# EAGLE design Carrier (corrected) (EAGLE 7.6.0)
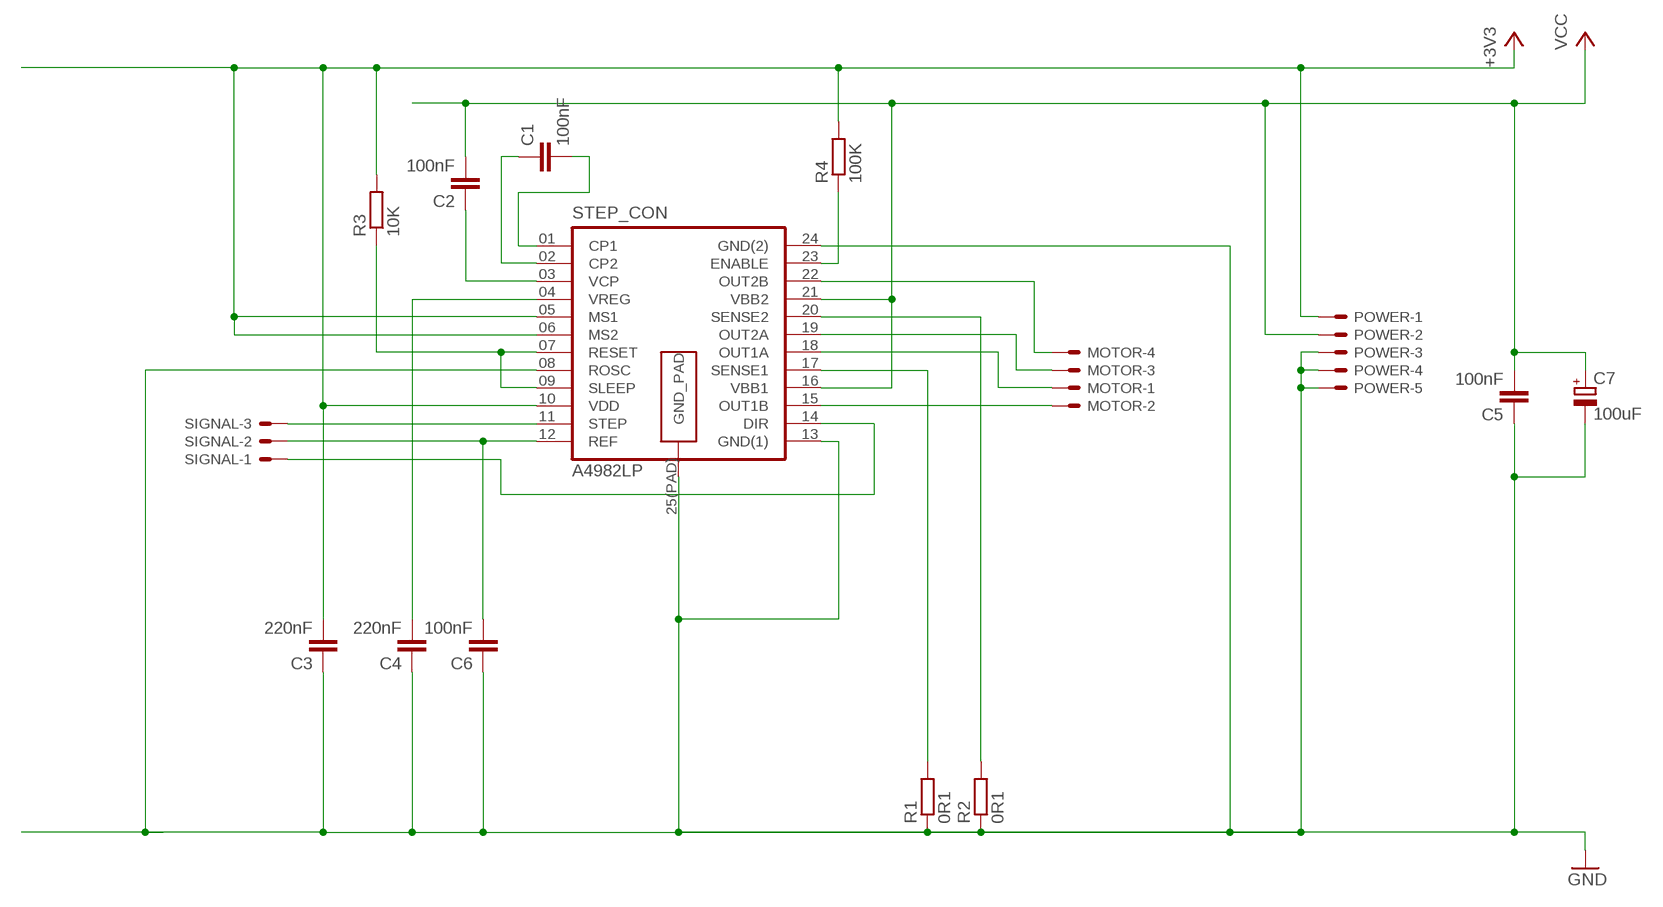
[diagram p0: schematic, sheet 1]

## Parts
C1  100nF  C-EUC1206  [C1206]
C2  100nF  C-EUC1206  [C1206]
C3  220nF  C-EUC1206  [C1206]
C4  220nF  C-EUC1206  [C1206]
C5  100nF  C-EUC1206  [C1206]
C6  100nF  C-EUC1206  [C1206]
C7  100uF  CPOL-EUB45181A  [B45181A]
MOTOR  KK-156-4  [KK-156-4]
POWER  KK-156-5  [KK-156-5]
R1  0R1  R-EU_M0805  [M0805]
R2  0R1  R-EU_M0805  [M0805]
R3  10K  R-EU_M0805  [M0805]
R4  100K  R-EU_M0805  [M0805]
SIGNAL  KK-156-3  [KK-156-3]
STEP_CON  A4982LP  [A4982LP]

## Nets
+3V3: C3.2 POWER.1 R3.2 R4.2 STEP_CON.05(MS1) STEP_CON.06(MS2) STEP_CON.10(VDD)
CP1: C1.2 STEP_CON.01(CP1)
CP2: C1.1 STEP_CON.02(CP2)
DIR: SIGNAL.1 STEP_CON.14(DIR)
ENABLE: R4.1 STEP_CON.23(ENABLE)
GND: C3.1 C4.1 C5.1 C6.1 C7.- POWER.3 POWER.4 POWER.5 R1.1 R2.1 STEP_CON.08(ROSC) STEP_CON.13(GND(1)) STEP_CON.24(GND(2)) STEP_CON.25(PAD)(GND_PAD)
OUT1A: MOTOR.1 STEP_CON.18(OUT1A)
OUT1B: MOTOR.2 STEP_CON.15(OUT1B)
OUT2: MOTOR.3 STEP_CON.19(OUT2A)
OUT2B: MOTOR.4 STEP_CON.22(OUT2B)
REF: C6.2 SIGNAL.2 STEP_CON.12(REF)
RESET+SLEEP: R3.1 STEP_CON.07(RESET) STEP_CON.09(SLEEP)
SENSE: R2.2 STEP_CON.20(SENSE2)
SENSE1: R1.2 STEP_CON.17(SENSE1)
STEP: SIGNAL.3 STEP_CON.11(STEP)
VCC: C2.2 C5.2 C7.+ POWER.2 STEP_CON.16(VBB1) STEP_CON.21(VBB2)
VCP: C2.1 STEP_CON.03(VCP)
VREG: C4.2 STEP_CON.04(VREG)

## Library data of the parts
C1-C6 = rcl:C-EU: CAPACITOR, European symbol
C7 = rcl:CPOL-EU: POLARIZED CAPACITOR, European symbol
MOTOR = con-molex:KK-156-4: KK 156 HEADER Source: http://www.molex.com/pdm_docs/sd/026604100_sd.pdf; OC_FARNELL: unknown; OC_NEWARK: unknown
POWER = con-molex:KK-156-5: KK 156 HEADER Source: http://www.molex.com/pdm_docs/sd/026604100_sd.pdf; OC_FARNELL: unknown; OC_NEWARK: unknown
R1-R4 = rcl:R-EU_: RESISTOR, European symbol
SIGNAL = con-molex:KK-156-3: KK 156 HEADER Source: http://www.molex.com/pdm_docs/sd/026604100_sd.pdf; OC_FARNELL: unknown; OC_NEWARK: unknown
STEP_CON = allegro:A4982LP

## Board
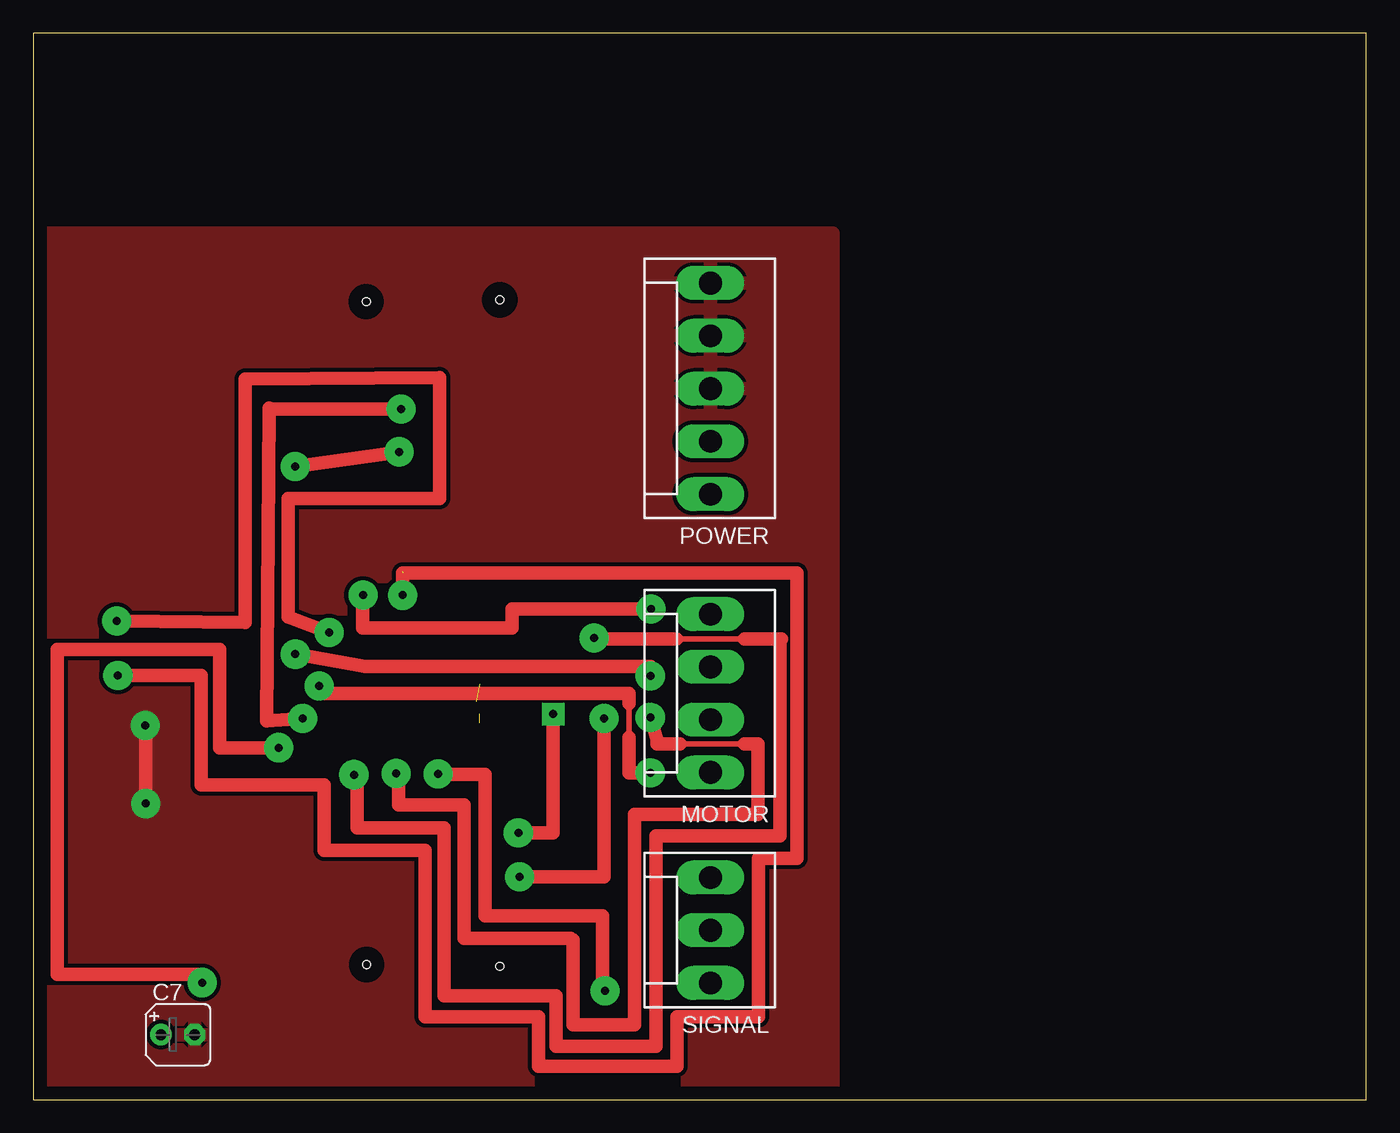
[diagram p1: board, top side]
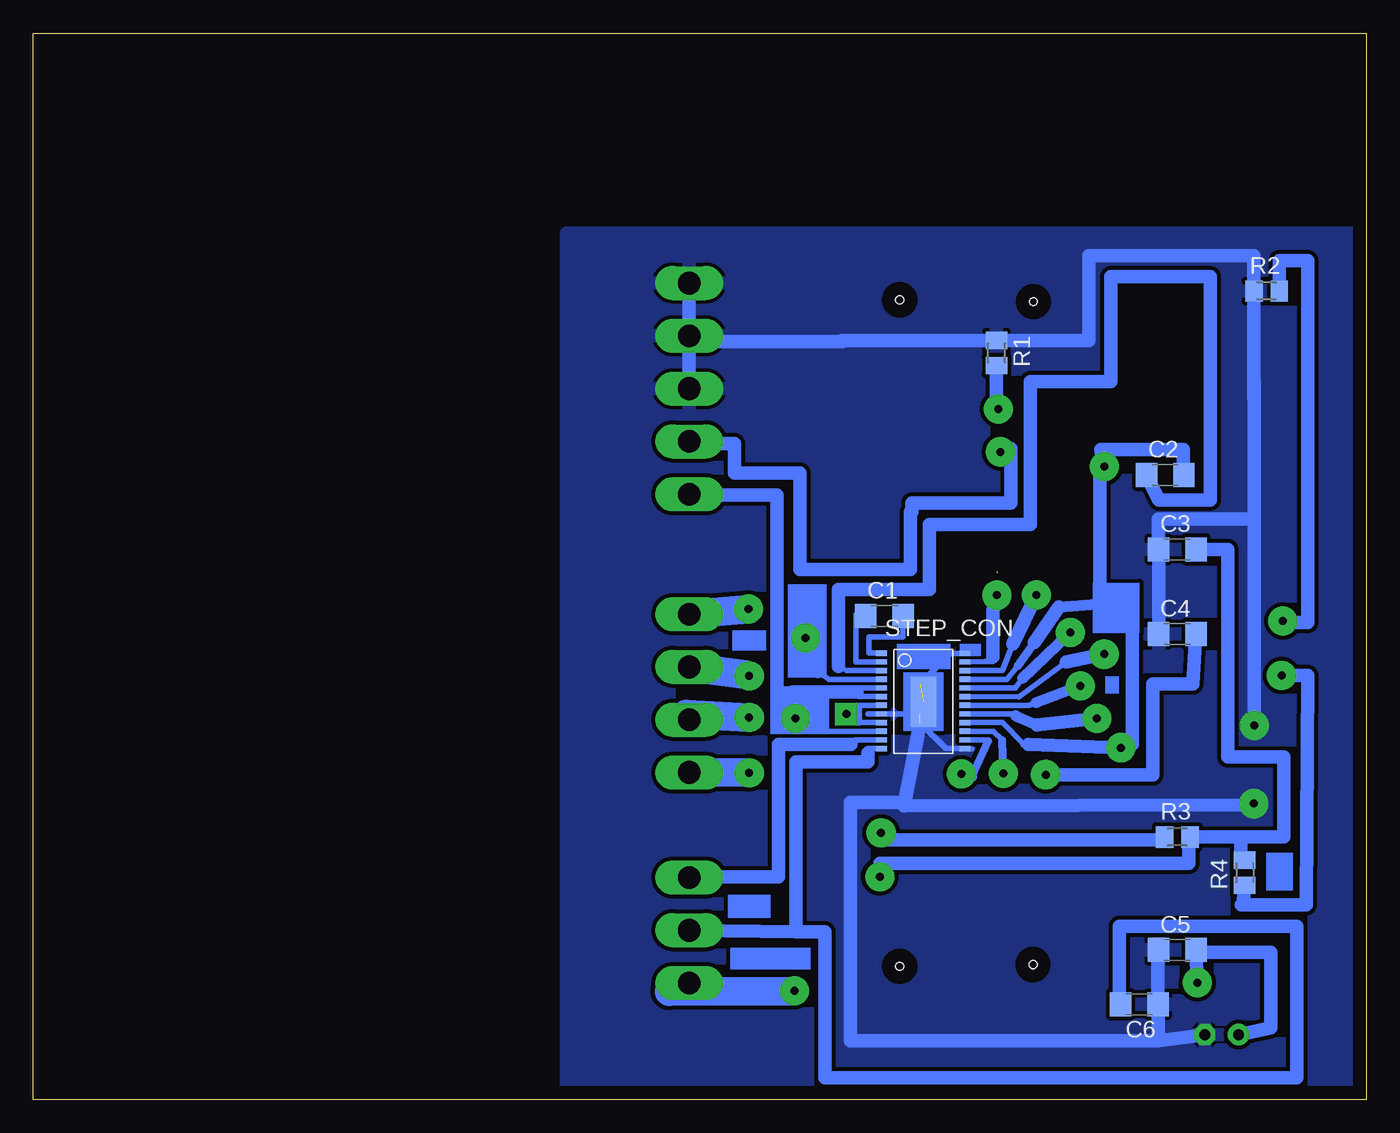
[diagram p2: board, bottom side, seen from below]

Size 100 x 80 mm. Coordinates in mm from the lower left corner, seen from the top.
Outline: 0,0 100,0 100,80 0,80 0,0
Copper layers (1*16): Top 0.035mm / dielectric 1.5mm / Bottom 0.035mm
Design rules "default *": minimum track width 10mil, minimum drill 24mil, track to track 12mil, track to pad 12mil, pad to pad 12mil, via to via 12mil, smd to smd 8mil, copper to edge 40mil, drill to drill 12mil, minimum pad ring 10mil, minimum via ring 8mil, stop-mask expansion 4mil, vias tented up to drill 0mil, thermal gap 10mil
Holes 0.6 mm at 25,10.12 24.98,59.88 35,60 35,10

### Footprints (pad centres in the part's own frame; a part is rotated, then mirrored left to right if it is on the bottom)
C1206 = smd 1.6 x 1.8: 1 -1.4,0; 2 1.4,0
B45181A = drill 0.813 pad 1.6: + -1.27,0 | drill 0.813 pad 1.6 octagon: - 1.27,0
KK-156-4 = drill 1.7 pad 2.184 long: 1 -5.94,0; 2 -1.98,0; 3 1.98,0; 4 5.94,0
KK-156-5 = drill 1.7 pad 2.184 long: 1 -7.92,0; 2 -3.96,0; 3 0,0; 4 3.96,0; 5 7.92,0
M0805 = smd 1.3 x 1.6: 1 -0.95,0; 2 0.95,0
KK-156-3 = drill 1.7 pad 2.184 long: 1 -3.96,0; 2 0,0; 3 3.96,0
A4982LP = smd 0.406 x 0.813: 01 -3.647,-3.132; 02 -2.979,-3.132; 03 -2.329,-3.135; 04 -1.679,-3.135; 05 -1.029,-3.135; 06 -0.379,-3.135; 07 0.271,-3.135; 08 0.921,-3.135; 09 1.571,-3.135; 10 2.221,-3.135; 11 2.871,-3.135; 12 3.521,-3.135; 13 3.521,3.115; 14 2.871,3.115; 15 2.221,3.115; 16 1.571,3.115; 17 0.921,3.115; 18 0.281,3.115; 19 -0.379,3.115; 20 -1.029,3.115; 21 -1.679,3.115; 22 -2.329,3.115; 23 -2.979,3.115; 24 -3.629,3.115 | smd 3.81 x 1.93: 25(PAD) 0,0

### Placement (x,y rotation side)
C1  36.15,36.28 0 bottom
C2  15.08,46.87 0 bottom
C3  14.18,41.28 0 bottom
C4  14.18,34.94 0 bottom
C5  14.18,11.22 0 bottom
C6  17.02,7.16 180 bottom
C7  10.84,4.87 0 top
MOTOR  50.8,30.48 90 top
POWER  50.8,53.34 90 top
R1  27.73,56.02 270 bottom
R2  7.47,60.66 0 bottom
R3  14.18,19.7 0 bottom
R4  9.12,17.02 90 bottom
SIGNAL  50.8,12.7 90 top
STEP_CON  33.23,29.86 270 bottom

### Tracks (layer width: path | path; a pad name or v marks a point on that pad's centre or on a via)
+3V3  (via drill 0.6 pad 2.18)
  Top 1.016: v36.49,16.72 42.83,16.72 v42.83,28.6
  Bottom 0.406: 44.2,30.8 | 42.83,28.7 v42.83,28.6 | STEP_CON.05 38.1,30.88 38.2,30.58 38.1,30.23 STEP_CON.06 | v42.83,28.6 42.93,28.6 | STEP_CON.10 42.83,27.63 v42.83,28.6
  Bottom 1.016: 44.2,30.8 44.2,45.36 51.01,45.36 POWER.1 | 9.43,19.7 R3.2 13.32,19.7 13.32,17.73 36.49,17.73 v36.49,16.72 | 9.43,19.7 6.2,19.7 6.2,25.7 10.4,25.7 10.4,41.27 C3.2 | R4.2 9.43,18.3 9.43,19.7 | 44.2,30.8 44.2,28.7 42.83,28.7 | 42.93,28.6 43.03,30.58 38.2,30.58
CP1
  Bottom 0.406: STEP_CON.01 37.3,33.5 37.3,34.7 34.75,34.7 C1.2
CP2
  Bottom 0.406: STEP_CON.02 38.3,32.83 38.3,36.4 37.55,36.4 C1.1
DIR  (via drill 0.6 pad 2.18)
  Top 1.016: 30.23,24.43 v30.38,24.43 30.38,24.4 33.9,24.4 33.9,13.8 42.7,13.8 42.7,8.13 42.9,8.13 v42.9,8.15
  Bottom 0.406: STEP_CON.14 28.93,26.98 | 28.93,26.98 28.61,26.98 | 28.35,26.9 28.93,26.98
  Bottom 0.61: 29.59,24.21 28.35,26.9
  Bottom 0.813: v30.38,24.43 29.59,24.21
  Bottom 1.016: SIGNAL.1 52.3,8.12
  Bottom 2.184: 52.3,8.12 v42.9,8.15
ENABLE  (via drill 0.6 pad 2.18)  (1 unrouted)
  Top 1.016: v6.35,31.82 12.6,31.82 12.6,23.6 21.8,23.6 21.8,18.7 29.4,18.7 29.4,6.2 37.9,6.2 37.9,2.5 48.3,2.5 48.3,6.2 54.4,6.2 54.4,18.1 57.3,18.1 57.3,39.5 27.7,39.5 v27.7,37.84
  Bottom 0.406: STEP_CON.23 28.57,32.87 28,32.87 28,33.2
  Bottom 1.016: v27.7,37.84 27.7,37.46 28,36.73 28,33.2 | R4.1 9.28,14.62 9.38,14.6 4.5,14.6 4.4,31.82 v6.35,31.82
GND  (via drill 0.6 pad 2.18)  (2 unrouted)
  Top 1.016: v8.4,28.06 8.45,27.3 v8.45,22.2
  Bottom 0.406: 29.57,26.32 29.91,26.33 STEP_CON.13 31.53,26.33 33.48,28.27 | 29.12,33.48 STEP_CON.24 30.22,33.48 30.23,33.48 31.2,33.48 33.48,31.2 | 33.48,28.93 STEP_CON.08 37.04,28.93 37.38,28.93
  Bottom 1.016: POWER.3 POWER.4 | POWER.4 POWER.5 | C7.- 15.6,4.4 | 15.6,4.4 38.7,4.4 38.7,22.3 34.77,22.3 34.67,22.02 | 15.6,4.4 15.6,7 | 8.45,22.1 v8.45,22.2 | v8.45,22.2 8.42,22.75 | C4.1 C3.1 15.6,41.28 15.6,43.55 8.45,43.55 | STEP_CON.25(PAD) 33.15,29.86 34.67,22.02 | 34.67,22.02 8.45,22.1 | C5.1 15.62,11.22 C6.1 | v8.4,28.06 8.4,53.92 8.42,52.65 R2.1 8.42,63.3 20.8,63.3 20.8,56.95 39.33,56.95 39.33,56.88 51.01,56.88 POWER.4 | v8.45,22.2 8.45,22.1
  pour Bottom: 0,0 60,0 60,65 0,65
  pour Top: 0,65 60,65 60,0 0,0
N$14
  Bottom 0.406: 30.23,29.57 25.35,29.57
OUT1A  (via drill 0.6 pad 2.18)
  Top 0.406: 44.7,27.18 44.7,29.72
  Top 1.016: v46.29,24.52 44.7,24.52 44.7,27.18 | 44.7,29.72 44.7,30.48 21.44,30.48 v21.44,31.03
  Bottom 0.406: STEP_CON.18 27.96,29.58 27.95,29.57 25.35,29.57 24.77,29.76
  Bottom 0.813: v21.44,31.03 24.77,29.76
  Bottom 2.184: v46.29,24.52 MOTOR.1
OUT1B  (via drill 0.6 pad 2.18)
  Top 0.406: 53.34,26.67 48.51,26.67
  Top 1.016: v46.29,28.67 46.8,26.98 46.8,26.67 48.51,26.67 | v27.23,24.48 27.2,24.48 | 53.34,26.67 54.36,26.67 54.36,21.4 45.1,21.4 45.1,5.6 40.5,5.6 40.5,12 40.3,12 40.3,12.1 32.3,12.1 32.3,22.1 27.4,22.1 27.4,24.5 27.2,24.5 27.2,24.48 | 27.18,24.48 27.2,24.48
  Bottom 0.406: STEP_CON.15 27.96,27.63 27.3,26.98
  Bottom 0.61: v27.23,24.48 27.3,26.98
  Bottom 1.016: MOTOR.2 51.02,28.93
  Bottom 2.184: 51.02,28.93 v46.29,28.67
OUT2  (via drill 0.6 pad 2.18)
  Top 1.016: v19.66,33.41 24.89,32.51 46.29,32.51 v46.29,31.78
  Bottom 0.406: 22.48,32.84 26.07,30.23 STEP_CON.19
  Bottom 1.016: 46.55,31.88 v46.29,31.78 | v19.66,33.41 22.48,32.84
  Bottom 2.184: MOTOR.3 46.55,31.88
OUT2B  (via drill 0.6 pad 2.18)
  Top 1.016: v24.73,37.85 24.7,37.85 24.7,35.4 35.9,35.4 35.9,36.8 v46.33,36.8
  Bottom 0.406: STEP_CON.22 27.29,32.18 26.51,34.2
  Bottom 1.016: v24.73,37.85 26.51,34.2
  Bottom 2.184: MOTOR.4 v46.33,36.8
REF
  Bottom 0.406: STEP_CON.12 37.37,26.33 37.38,26
  Bottom 1.016: SIGNAL.2 42.79,12.58 | 42.79,12.58 40.62,12.58 40.62,1.62 5.2,1.62 5.2,13 18.52,13 18.52,6.83 C6.2 | 37.38,26 37.38,25.35 42.79,25.35 42.79,12.58
RESET+SLEEP  (via drill 0.6 pad 1.68, 0.6 pad 2.18)
  Top 1.016: v36.39,20.01 39,20.01 v39,28.93
  Bottom 0.406: STEP_CON.09 37.71,28.28 38.02,28.27 38.02,28.93 | 36.4,29.57 STEP_CON.07 36.39,29.58 36.4,29.57 | 36.4,29.57 38.02,29.57 38.02,28.93 | 38.02,28.93 38.35,28.93
  Bottom 1.016: 38.35,28.93 v39,28.93 | R3.1 15.12,19.5 36.39,19.5 v36.39,20.01
SENSE  (via drill 0.6 pad 2.18)
  Top 1.016: v6.25,35.9 15.91,35.8 15.91,54.05 30.48,54.15 30.48,45.1 19.1,45.1 19.1,36.2 v22.2,35.04
  Bottom 0.406: STEP_CON.20 26.32,30.88 25.79,31.6
  Bottom 0.813: 25.79,31.6 v22.2,35.04
  Bottom 1.016: R2.2 6.52,62.94 4.4,62.94 4.4,35.8 5.74,35.8 v6.25,35.9
SENSE1  (via drill 0.6 pad 2.18)
  Top 1.016: v20.2,28.6 17.5,28.4 17.7,51.7 | 17.7,51.7 17.7,51.9 | v27.6,51.8 17.7,51.8 17.7,51.7
  Bottom 0.406: STEP_CON.17 26.3,28.93 26.3,28.8
  Bottom 0.813: 26.3,28.8 24.7,28.1
  Bottom 1.016: 24.7,28.1 v20.2,28.6 | v27.6,51.8 27.73,51.8 R1.2
STEP
  Bottom 0.406: STEP_CON.11 38.34,26.98 38.67,26.65
  Bottom 1.016: 38.67,26.65 44.09,26.65 44.09,16.72 51.01,16.72 SIGNAL.3
VCC  (via drill 0.6 pad 2.18)
  Top 1.016: v27.44,48.6 v19.64,47.48 | v18.41,26.4 13.97,26.4 13.97,33.78 1.78,33.78 1.78,9.4 12.68,9.4 v12.68,8.78
  Bottom 0.406: STEP_CON.16 27.31,28.28 25.68,26.65 | STEP_CON.21 26.97,31.53 26.16,32.51 | v18.41,26.4 17.53,26.65 | 19.97,38.1 19.97,38.42 | 17.53,38.1 19.97,38.1 | 19.97,38.1 20.17,38.1 20.17,37.17
  Bottom 0.61: 25.35,26.65 25.68,26.65 | 24.89,34.29 26.16,32.51
  Bottom 0.813: 23.06,36.96 20.17,37.17
  Bottom 1.016: C7.+ 7.15,5.38 7.15,11.05 12.78,11.05 C5.2 v12.68,8.78 | 19.97,38.42 19.97,47.48 v19.64,47.48 19.9,48.77 13.72,48.77 13.72,46.87 C2.2 | v18.41,26.4 25.35,26.65 | v27.44,48.6 26.65,48.85 26.65,44.75 34.1,44.75 34.1,44.1 34.2,44.1 34.2,39.75 42.5,39.75 42.5,47.01 47.4,47.01 47.4,49.21 51.01,49.21 POWER.2 | 17.53,26.65 17.53,38.1 | 23.06,36.96 24.89,34.29
VCP
  Bottom 0.406: STEP_CON.03 39.01,32.18 39.58,32.5
  Bottom 1.016: C2.1 15.57,44.99 11.7,44.99 11.7,61.75 19.18,61.75 19.18,53.88 25.21,53.88 25.21,43.15 32.75,43.15 32.75,38.28 39.58,38.28 39.58,32.5
VREG  (via drill 0.6 pad 2.18)
  Top 0.406: 53.34,34.54 48.26,34.54
  Top 1.016: v24.05,24.38 24.05,24.7 24.3,24.7 24.3,20.4 30.8,20.4 30.8,7.8 39.2,7.8 39.2,4 46.7,4 46.7,19.8 56,19.8 56,34.54 | 56.13,34.54 56,34.54 | 56,34.54 53.34,34.54 | 48.26,34.54 42.07,34.54 v42.07,34.63
  Bottom 0.406: STEP_CON.04 40.31,31.53 41.13,32.1
  Bottom 1.016: 41.13,32.1 v42.07,34.63 | v24.05,24.38 16,24.38 16,31.2 13,31.2 C4.2
(copper drawn outside any net)
  shapes: Bottom area x10